# Altium schematic sheet AFC01-S05FCA-001_AFC01-S05FCA-00.schdoc
size 124 x 101 mm
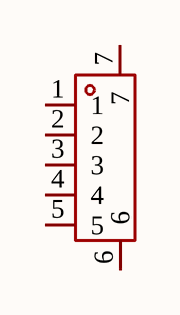
[diagram p0: AFC01-S05FCA-001_AFC01-S05FCA-00.schdoc]

## Parts
FPC?  AFC01-S05FCA-00  [FPC-SMD_AFC01-S05FCA-00]  (value not drawn)

## Nets

Not connected (* = marked no-connect by the designer): FPC? 1 2 3 4 5 6 7

## Library data of the parts
FPC? = AFC01-S05FCA-00: Manufacturer: JS(钜硕电子); Add into BOM: yes; Locking Feature: 翻盖式; Number of Contacts: 5P; Pitch: 0.5mm; FFC, FCB Thickness: 0.3mm; Symbol: AFC01-S05FCA-00; Device: AFC01-S05FCA-00; LCSC Part Name: 间距:0.5mm P数:5P 翻盖式 下接; Supplier Part: C262654; Manufacturer Part: AFC01-S05FCA-00; Supplier Footprint: SMD,P=0.5mm,卧贴; JLCPCB Part Class: Extended Part; Datasheet: https://item.szlcsc.com/datasheet/AFC01-S05FCA-00/253913.html; Supplier: LCSC; Convert to PCB: yes; Contact Type: 下接; Mounting Type: 卧贴; Height Above Board: 2mm